# Altium schematic sheet PRUC-Voltmeter_Config.SchDoc: Voltmeter / FPGA Config
size A4; SheetNumber: 8; SheetTotal: 9
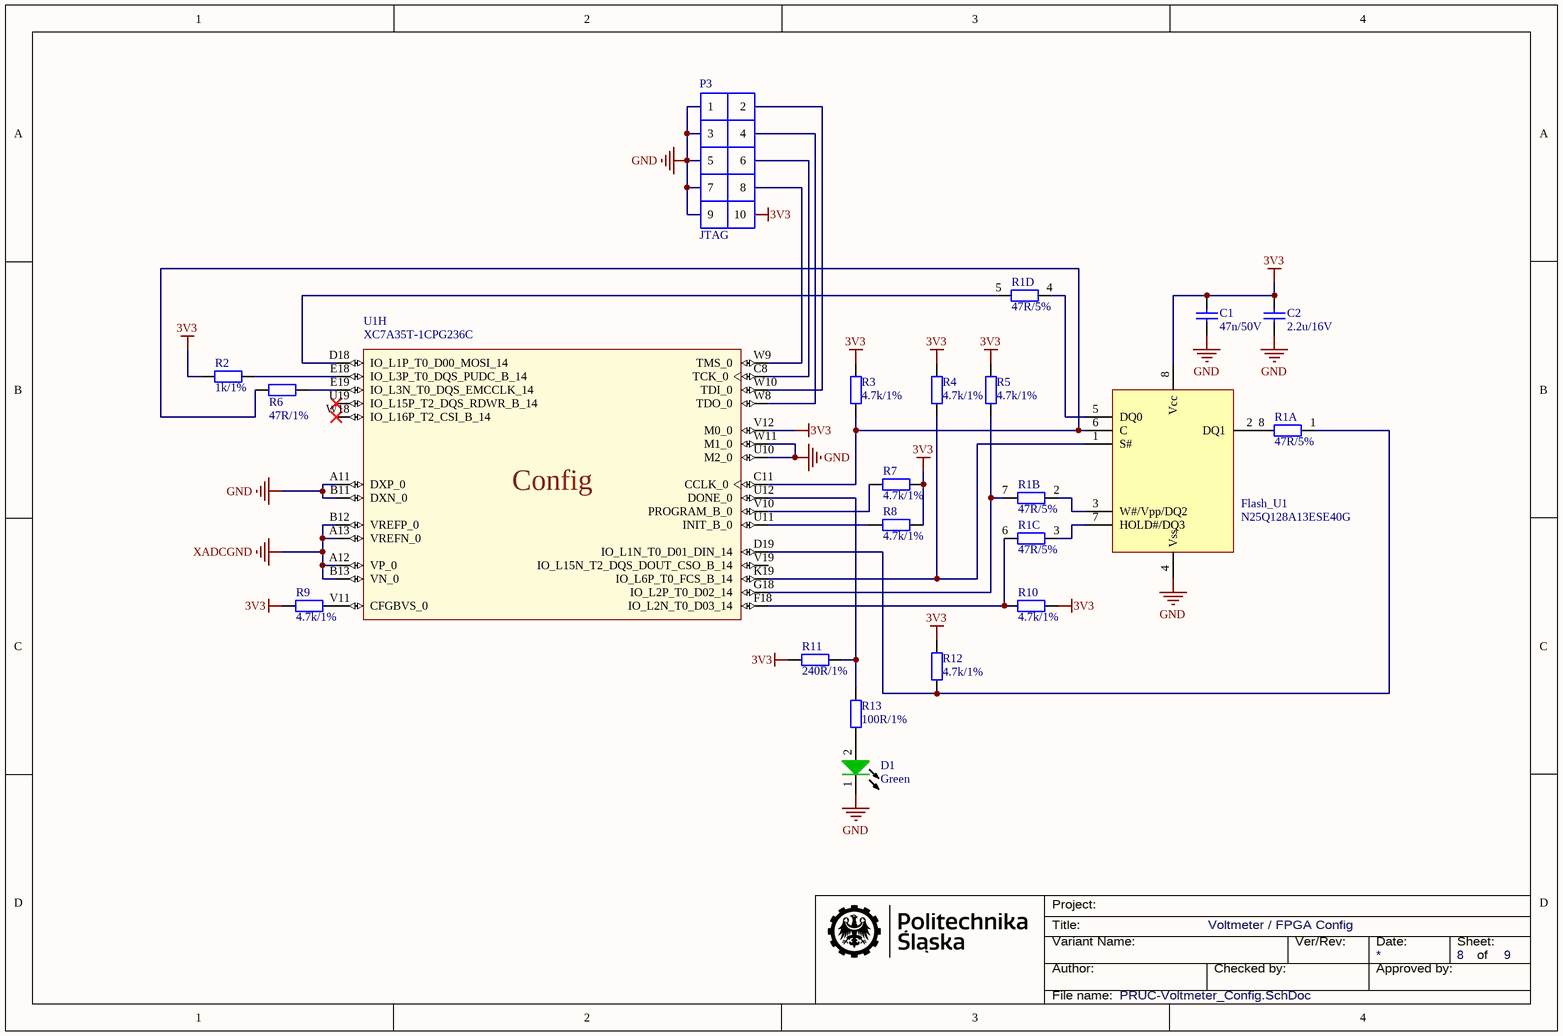
[diagram p0: PRUC-Voltmeter_Config.SchDoc]

## Parts
C1  47n/50V  [MLCC_0603]
C2  2.2u/16V  [MLCC_0603]
D1  Green  [LED_0603_G]
Flash_U1  (no value)  [SOIC-8-W]
P3  JTAG  [DS1021-10G]
R1  47R/5%  [ARRAY_R_0804]  (parts A,B,C,D of 4)
R2  1k/1%  [R_0603]
R3  4.7k/1%  [R_0603]
R4  4.7k/1%  [R_0603]
R5  4.7k/1%  [R_0603]
R6  47R/1%  [R_0603]
R7  4.7k/1%  [R_0603]
R8  4.7k/1%  [R_0603]
R9  4.7k/1%  [R_0603]
R10  4.7k/1%  [R_0603]
R11  240R/1%  [R_0603]
R12  4.7k/1%  [R_0603]
R13  100R/1%  [R_1206]
U1  XC7A35T-1CPG236C  [CPG236-0.5mm]  (part H of 8)

## Nets
3V3: C1.1 C2.1 Flash_U1.8(Vcc) P3.10 R2.1 R3.1 R4.1 R5.2 R7.2 R8.2 R9.1 R10.2 R11.1 R12.1 U1.V12(M0_0)
GND: C1.2 C2.2 D1.1(K) Flash_U1.4(Vss) P3.1 P3.3 P3.5 P3.7 P3.9 U1.A11(DXP_0) U1.B11(DXN_0) U1.U10(M2_0) U1.W11(M1_0)
XADCGND: U1.A12(VP_0) U1.A13(VREFN_0) U1.B12(VREFP_0) U1.B13(VN_0)
NetD1_2: D1.2(A) R13.2
NetFlash_U1_1: Flash_U1.1(S#) R4.2 U1.K19(IO_L6P_T0_FCS_B_14)
NetFlash_U1_2: Flash_U1.2(DQ1) R1.8
NetFlash_U1_3: Flash_U1.3(W#/Vpp/DQ2) R1.2
NetFlash_U1_5: Flash_U1.5(DQ0) R1.4
NetFlash_U1_6: Flash_U1.6(C) R3.2 R6.1 U1.C11(CCLK_0)
NetFlash_U1_7: Flash_U1.7(HOLD#/DQ3) R1.3
NetP3_2: P3.2 U1.W10(TDI_0)
NetP3_4: P3.4 U1.W8(TDO_0)
NetP3_6: P3.6 U1.C8(TCK_0)
NetP3_8: P3.8 U1.W9(TMS_0)
NetR1_1: R1.1 R12.2 U1.D19(IO_L1N_T0_D01_DIN_14)
NetR1_5: R1.5 U1.D18(IO_L1P_T0_D00_MOSI_14)
NetR1_6: R1.6 R10.1 U1.F18(IO_L2N_T0_D03_14)
NetR1_7: R1.7 R5.1 U1.G18(IO_L2P_T0_D02_14)
NetR2_2: R2.2 U1.E18(IO_L3P_T0_DQS_PUDC_B_14)
NetR6_2: R6.2 U1.E19(IO_L3N_T0_DQS_EMCCLK_14)
NetR7_1: R7.1 U1.V10(PROGRAM_B_0)
NetR8_1: R8.1 U1.U11(INIT_B_0)
NetR9_2: R9.2 U1.V11(CFGBVS_0)
NetR11_2: R11.2 R13.1 U1.U12(DONE_0)

Not connected (* = marked no-connect by the designer): U1 U19(IO_L15P_T2_DQS_RDWR_B_14)* V19(IO_L15N_T2_DQS_DOUT_CSO_B_14) W18(IO_L16P_T2_CSI_B_14)*

## Notes on the sheet
- Project:
- Title:
- Variant Name:
- Author:
- Checked by:
- Ver/Rev:
- Date:
- Approved by:
- Sheet:
- of
- File name:
- (in symbol XC7A35T-1CPG236C, part H) Config

## Library data of the parts
C1 = CL10B473KB8NNNC: Manufacturer: Samsung; Part Description: 0603 General Multilayer Ceramic Capacitor; Index: 160; Part Number: CL10B473KB8NNNC; Value: 47n/50V; SMD: true; Manufacturer Part Number: CL10B473KB8NNNC; Supplier 1: TME; Supplier Part Number 1: CL10B473KB8NNNC; HelpURL: https://www.tme.eu/Document/4a42202b32dab16128fe107dd69598cc/samsung-chip-cap.pdf; Category: Capacitors
C2 = CL10A225KO8NNNC: Manufacturer: Samsung; Part Description: 0603 General Multilayer Ceramic Capacitor; Index: 71; Part Number: CL10A225KO8NNNC; Value: 2.2u/16V; SMD: true; Manufacturer Part Number: CL10A225KO8NNNC; Supplier 1: TME; Supplier Part Number 1: CL10A225KO8NNNC; HelpURL: https://www.tme.eu/pl/Document/7da762c1dbaf553c64ad9c40d3603826/mlcc_samsung.pdf; Category: Capacitors
D1 = KPT-1608MGC: Manufacturer: Kingbright Electronic; Part Description: 0603 Chip LED Green; Index: 133; Part Number: KPT-1608MGC; Value: Green; SMD: true; Manufacturer Part Number: KPT-1608MGC; Supplier 1: TME; Supplier Part Number 1: KPT-1608MGC; HelpURL: https://www.tme.eu/Document/ccb7facb67f7c92dede6afa2fc24e9b1/KPT-1608MGC%28Ver.17B%29.pdf; Category: Diodes
Flash_U1 = N25Q128A13ESE40G: 128Mbit, 3V Serial NOR Flash Memory; Manufacturer: Micron; ManufacturerPartNumber: N25Q128A13ESE40G
P3 = ZL202-10G: Manufacturer: Connfly; Manufacturer Part Number: DS1021-2*5SF11; Part Description: 2.54mm PIN Header V/T Type. Single Row; Index: 82; Value: 2x5/2.54mm; Part Number: ZL202-10G; SMD: false; Supplier 1: TME; Supplier Part Number 1: ZL202-10G; HelpURL: https://www.tme.eu/Document/cc301e58a5da78cb543a94b5a5b7f06a/DS1021.pdf; Category: Connectors
R1 = YC124-JR-0747RL: Manufacturer: Yageo; Part Description: 0804 Array Chip Resistors; Index: 17; Part Number: YC124-JR-0747RL; Value: 47R/5%; SMD: true; Manufacturer Part Number: YC124-JR-0747RL; Supplier 1: TME; Supplier Part Number 1: YC124-JR-0747RL; HelpURL: https://www.tme.eu/pl/Document/d813da3fbd3f246b462e11fb35fa7b68/YC_TC124.pdf; Category: Resistors
R2 = 0603SAF1001T5E: Manufacturer: Royalohm; Part Description: 0603 Thick Film Chip Resistor; Index: 7; Part Number: 0603SAF1001T5E; Value: 1k/1%; SMD: true; Manufacturer Part Number: 0603SAF1001T5E; Supplier 1: TME; Supplier Part Number 1: SMD0603-1K-1%; HelpURL: https://www.tme.eu/pl/Document/b315665a56acbc42df513c99b390ad98/ROYALOHM-THICKFILM.pdf; Category: Resistors
R3-R5 R7-R10 R12 = 0603SAF4701T5E: Manufacturer: Royalohm; Manufacturer Part Number: SMD0603-4K7-1%; Part Description: 0603 Thick Film Chip Resistor; Index: 44; Part Number: 0603SAF4701T5E; Value: 4.7k/1%; SMD: true; Supplier 1: TME; Supplier Part Number 1: SMD0603-4K7-1%; HelpURL: https://www.tme.eu/Document/b315665a56acbc42df513c99b390ad98/ROYALOHM-THICKFILM.pdf; Category: Resistors
R6 = 0603SAF470JT5E: Manufacturer: Royalohm; Part Description: 0603 Thick Film Chip Resistor; Index: 12; Part Number: 0603SAF470JT5E; Value: 47R/1%; SMD: true; Manufacturer Part Number: 0603SAF470JT5E; Supplier 1: TME; Supplier Part Number 1: SMD0603-47R-1%; HelpURL: https://www.tme.eu/pl/Document/b315665a56acbc42df513c99b390ad98/ROYALOHM-THICKFILM.pdf; Category: Resistors
R11 = 0603SAF0241T5E: Manufacturer: Royalohm; Part Description: 0603 Thick Film Chip Resistor; Index: 10; Part Number: 0603SAF0241T5E; Value: 240R/1%; SMD: true; Manufacturer Part Number: 0603SAF0241T5E; Supplier 1: TME; Supplier Part Number 1: 0603SAF0241T5E; HelpURL: https://www.tme.eu/pl/Document/b315665a56acbc42df513c99b390ad98/ROYALOHM-THICKFILM.pdf; Category: Resistors
R13 = 1206S4F1000T5E: Manufacturer: Royalohm; Part Description: Ryalohm Thick Film Chip Resistors; Index: 75; Part Number: 1206S4F1000T5E; Value: 100R/1%; SMD: true; Manufacturer Part Number: 1206S4F1000T5E; Supplier 1: TME; Supplier Part Number 1: SMD1206-100R-1%; HelpURL: https://www.tme.eu/Document/d5a5e6c4d80848389d3e229cdaf353c1/general.pdf; Category: Resistors
U1 = XC7A35T-1CPG236C: Manufacturer: Xilinx; Part Description: Xilinx 7 Series FPGA; Index: 159; Value: 33280 Cells; Part Number: XC7A35T-1CPG236C; SMD: true; Manufacturer Part Number: XC7A35T-1CPG236C; Supplier 1: Mouser; Supplier Part Number 1: 217-XC7A35T-1CPG236C; HelpURL: https://pl.mouser.com/datasheet/2/903/ds180_7Series_Overview-1591537.pdf; Category: FPGA